# Altium schematic sheet AMP_CHANNEL.SchDoc
size A4
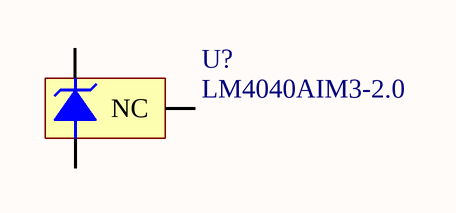
[diagram p0: AMP_CHANNEL.SchDoc]

## Parts
U?  LM4040AIM3-2.0  [MF03A_N]

## Nets

Not connected (* = marked no-connect by the designer): U? 1(+V) 2(-V) 3(NC)

## Library data of the parts
U? = LM4040AIM3-2.0: Precision Micropower Shunt Voltage Reference; Manufacturer: National Semiconductor; CompType: Voltage Reference IC; PackageTopMarking: RJA*XTT; PowerWise: N; Published: 4-Dec-2008; DatasheetVersion: Apr-2005; PackageVersion: revB, Mar-2003; PackageReference: MF03A; Publisher: Altium Limited; PackageDescription: Molded SOT-23, .115 x .051 x .037in Body, 3 Lead, .075 in Pitch; PartNumber: LM4040AIM3-2.0; RoHS: O; PinCount: 3; DigiKeyPartNumber: LM4040AIM3-2.0-ND; ComponentLink1Description: LM4040 Datasheet; ComponentLink1URL: http://www.national.com/ds/LM/LM4040.pdf; ComponentLink2Description: LM4040 Web Page; ComponentLink2URL: http://www.national.com/pf/LM/LM4040.html; ComponentLink3Description: MF03A Package Page; ComponentLink3URL: http://www.national.com/packaging/folders/mf03a.html